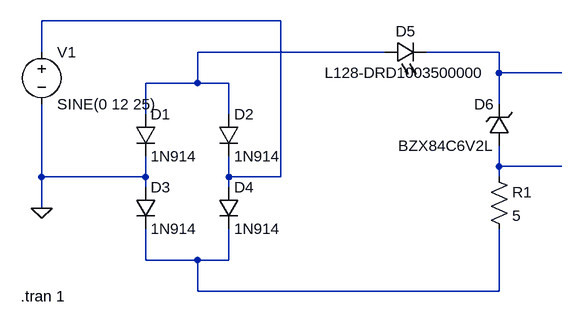
[diagram p0: schematic Draft2.asc]
Draft2.asc, the LTspice schematic file:
Version 4
SHEET 1 880 680
WIRE 272 16 -96 16
WIRE -96 64 -96 16
WIRE 432 64 144 64
WIRE 608 64 496 64
WIRE 608 96 608 64
WIRE 704 96 608 96
WIRE 144 112 144 64
WIRE 144 112 64 112
WIRE 192 112 144 112
WIRE 608 144 608 96
WIRE 64 160 64 112
WIRE 192 160 192 112
WIRE 608 240 608 208
WIRE 704 240 608 240
WIRE -96 256 -96 144
WIRE 64 256 64 224
WIRE 64 256 -96 256
WIRE 192 256 192 224
WIRE 272 256 272 16
WIRE 272 256 192 256
WIRE 608 256 608 240
WIRE 64 272 64 256
WIRE 192 272 192 256
WIRE -96 304 -96 256
WIRE 64 384 64 336
WIRE 144 384 64 384
WIRE 192 384 192 336
WIRE 192 384 144 384
WIRE 144 432 144 384
WIRE 608 432 608 336
WIRE 608 432 144 432
FLAG -96 304 0
SYMBOL diode 48 160 R0
SYMATTR InstName D1
SYMATTR Value 1N914
SYMBOL diode 176 160 R0
SYMATTR InstName D2
SYMATTR Value 1N914
SYMBOL diode 48 272 R0
SYMATTR InstName D3
SYMATTR Value 1N914
SYMBOL diode 176 272 R0
SYMATTR InstName D4
SYMATTR Value 1N914
SYMBOL voltage -96 48 R0
WINDOW 123 0 0 Left 0
WINDOW 39 0 0 Left 0
SYMATTR InstName V1
SYMATTR Value SINE(0 12 25)
SYMBOL LED 432 80 R270
WINDOW 0 32 32 VTop 2
WINDOW 3 0 32 VBottom 2
SYMATTR InstName D5
SYMATTR Value L128-DRD1003500000
SYMATTR Description Diode
SYMATTR Type diode
SYMBOL zener 624 208 R180
WINDOW 0 24 64 Left 2
WINDOW 3 24 0 Left 2
SYMATTR InstName D6
SYMATTR Value BZX84C6V2L
SYMATTR Description Diode
SYMATTR Type diode
SYMBOL res 592 240 R0
SYMATTR InstName R1
SYMATTR Value 5
TEXT -128 440 Left 2 !.tran 1

The netlist it stands for:
* Draft2.asc
D1 N002 0 1N914
D2 N002 N001 1N914
D3 0 N005 1N914
D4 N001 N005 1N914
V1 N001 0 SINE(0 12 25)
D5 N002 N003 L128-DRD1003500000
D6 N004 N003 BZX84C6V2L
R1 N004 N005 5
.model D D
.lib standard.dio
.tran 1
.backanno
.end